# EAGLE design TB66 (EAGLE 9.6.2)
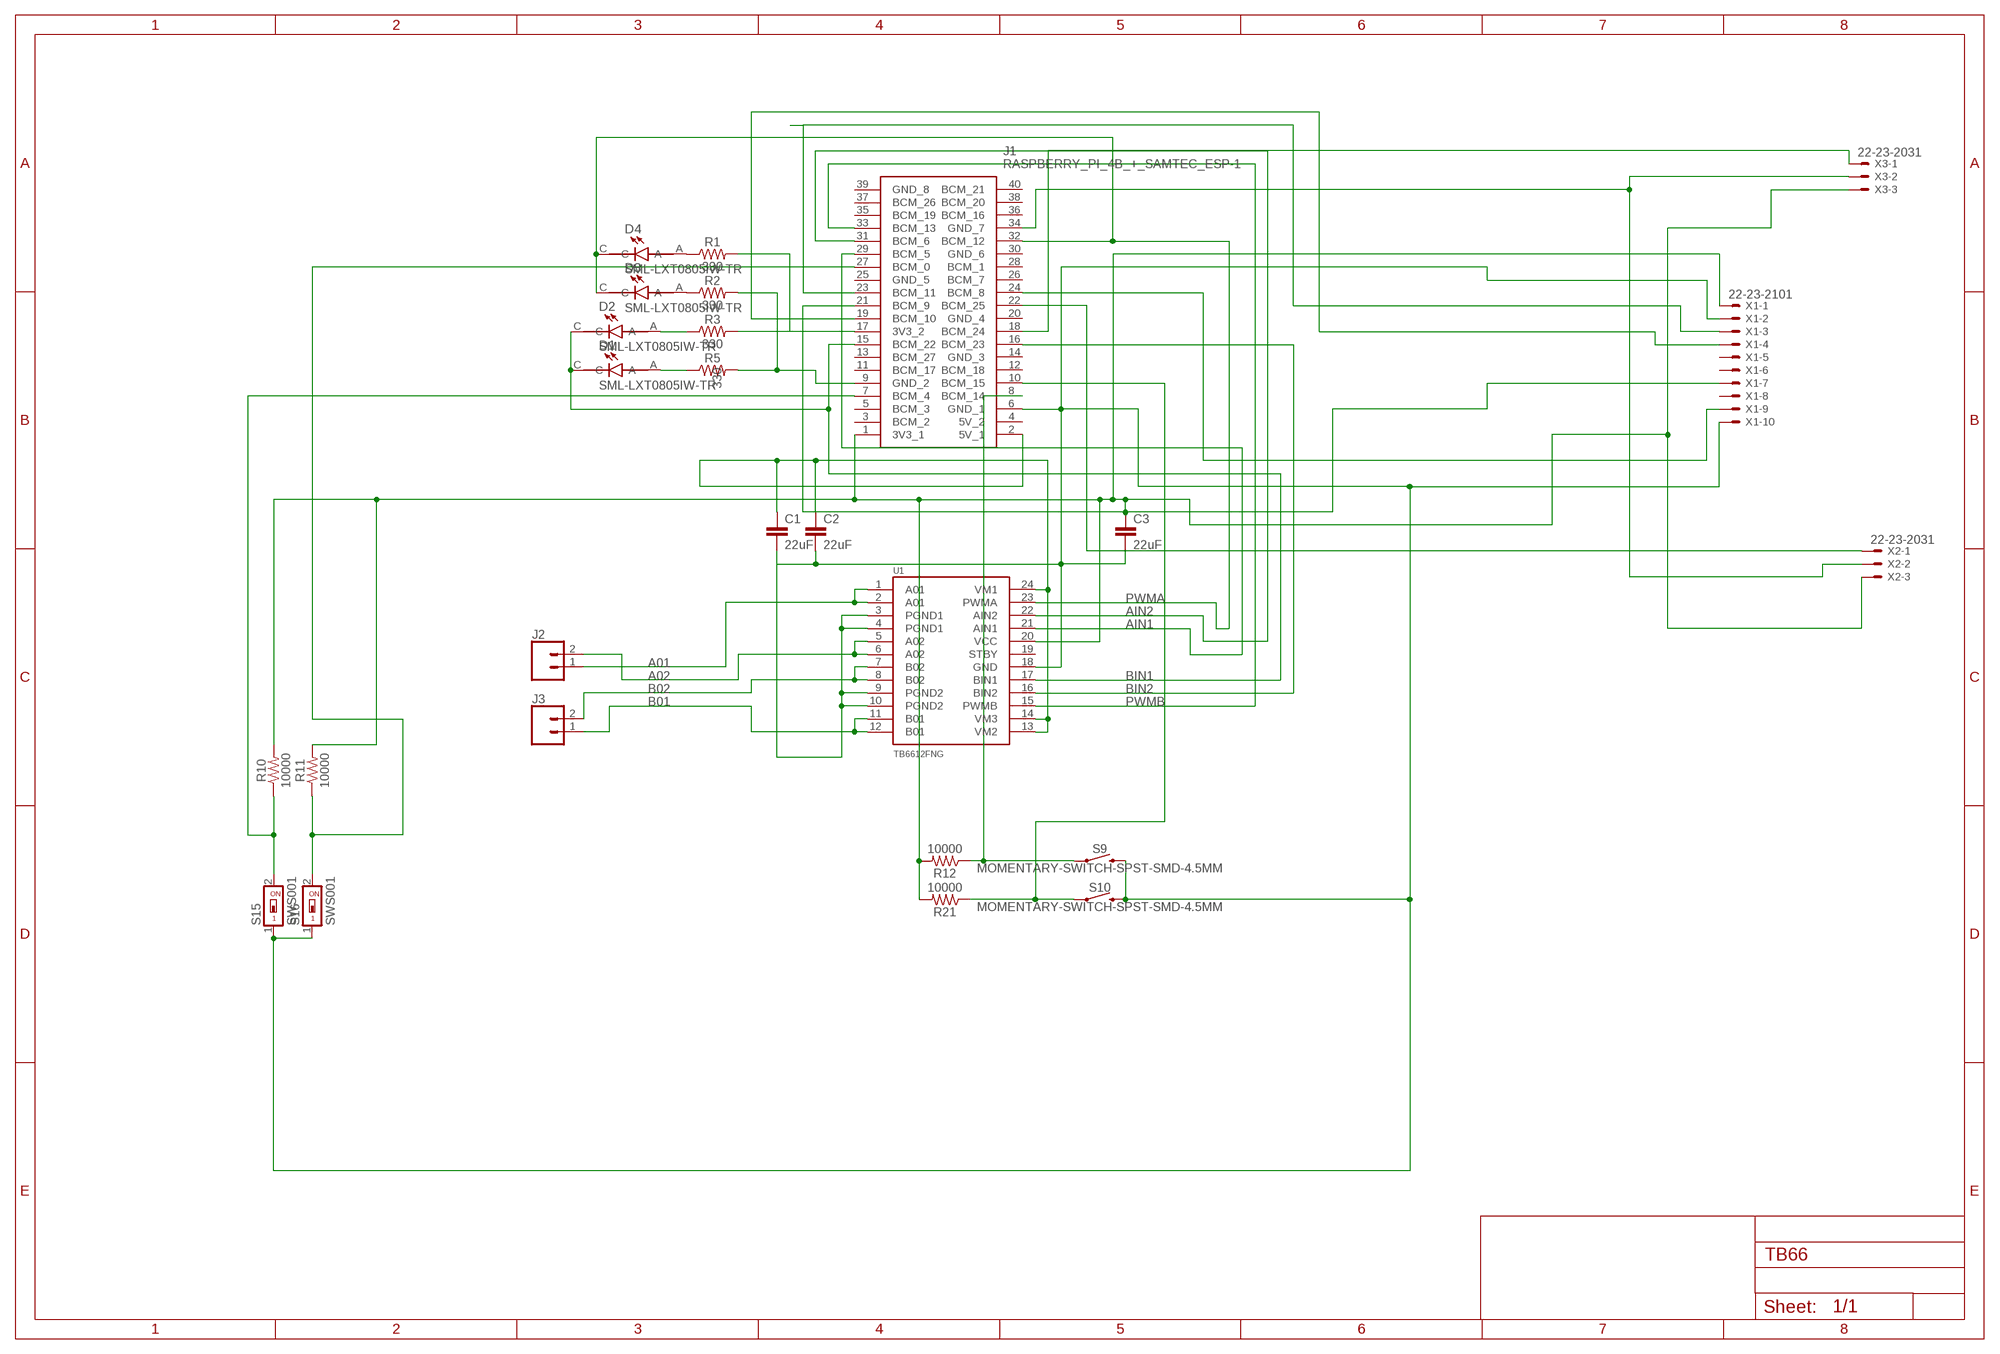
[diagram p0: schematic, sheet 1]

## Parts
C1  22uF  22UF-0805-6.3V-20%  [0805]
C2  22uF  22UF-0805-6.3V-20%  [0805]
C3  22uF  22UF-0805-6.3V-20%  [0805]
D1  SML-LXT0805IW-TR  [LEDC2012X120N]
D2  SML-LXT0805IW-TR  [LEDC2012X120N]
D3  SML-LXT0805IW-TR  [LEDC2012X120N]
D4  SML-LXT0805IW-TR  [LEDC2012X120N]
J1  RASPBERRY_PI_4B_+_SAMTEC_ESP-1  [RASPBERRYPI4B4GB]
J2  CONN_023.5MM  [SCREWTERMINAL-3.5MM-2]
J3  CONN_023.5MM  [SCREWTERMINAL-3.5MM-2]
R1  330  RESISTOR0805  [0805]
R2  330  RESISTOR0805  [0805]
R3  330  RESISTOR0805  [0805]
R5  330  RESISTOR0805  [0805]
R10  10000  RESISTOR0805  [0805]
R11  10000  RESISTOR0805  [0805]
R12  10000  RESISTOR0805  [0805]
R21  10000  RESISTOR0805  [0805]
S9  MOMENTARY-SWITCH-SPST-SMD-4.5MM  [TACTILE_SWITCH_SMD_4.5MM]
S10  MOMENTARY-SWITCH-SPST-SMD-4.5MM  [TACTILE_SWITCH_SMD_4.5MM]
S15  SWS001  [SMS-001]
S16  SWS001  [SMS-001]
U1  TB6612FNG  [SSOP24]
X1  22-23-2101  [22-23-2101]
X2  22-23-2031  [22-23-2031]
X3  22-23-2031  [22-23-2031]

## Nets
A01 [power]: J2.1 U1.1(A01) U1.2(A01)
A02 [power]: J2.2 U1.5(A02) U1.6(A02)
AIN1: J1.29(BCM_5) U1.21(AIN1)
AIN2: J1.31(BCM_6) U1.22(AIN2)
B01 [power]: J3.1 U1.11(B01) U1.12(B01)
B02 [power]: J3.2 U1.7(B02) U1.8(B02)
BIN1: D1.C D2.C J1.15(BCM_22) U1.17(BIN1)
BIN2: J1.16(BCM_23) U1.16(BIN2)
N$1: D3.A R2.1
N$2 [power]: J1.34(GND_7) X2.2 X3.2
N$3 [power]: C1.2 C2.2 C3.2 J1.6(GND_1) S9.1 S9.4 S10.1 S10.4 S15.1 S16.1 U1.3(PGND1) U1.4(PGND1) U1.9(PGND2) U1.10(PGND2) U1.18(GND) X1.2 X1.10
N$4 [power]: J1.17(3V3_2) R1.2 R3.2
N$5: D4.A R1.1
N$6: D1.A R5.1
N$7: J1.9(GND_2) R2.2 R5.2
N$8: D2.A R3.1
N$11 [power]: J1.18(BCM_24) X3.1
N$12: J1.23(BCM_11) X1.3
N$13: J1.19(BCM_10) X1.4
N$14: C3.1 J1.1(3V3_1) J1.21(BCM_9) R10.2 R11.2 R12.2 R21.2 U1.20(VCC) X1.1 X1.7 X2.3 X3.3
N$15: J1.24(BCM_8) X1.9
N$18 [power]: J1.22(BCM_25) X2.1
N$53: J1.8(BCM_14) R12.1 S9.2 S9.3
N$54: J1.10(BCM_15) R21.1 S10.2 S10.3
N$62: J1.7(BCM_4) R10.1 S15.2
N$63: J1.27(BCM_0) R11.1 S16.2
PWMA: D3.C D4.C J1.32(BCM_12) U1.23(PWMA)
PWMB: J1.33(BCM_13) U1.15(PWMB)
VM [power]: C1.1 C2.1 J1.2(5V_1) U1.13(VM2) U1.14(VM3) U1.24(VM1)
Unconnected: J1.3(BCM_2) J1.5(BCM_3) J1.11(BCM_17) J1.12(BCM_18) J1.13(BCM_27) J1.26(BCM_7) J1.28(BCM_1) J1.35(BCM_19) J1.36(BCM_16) J1.37(BCM_26) J1.38(BCM_20) J1.40(BCM_21) U1.19(STBY) X1.5 X1.6 X1.8

## Power pins joined to a net without a drawn wire
5V_2: J1.4(5V_2)
GND_3: J1.14(GND_3)
GND_4: J1.20(GND_4)
GND_5: J1.25(GND_5)
GND_6: J1.30(GND_6)
GND_8: J1.39(GND_8)

## Library data of the parts
C1-C3 = SparkFun-Capacitors:22UF: 22µF ceramic capacitors A capacitor is a passive two-terminal electrical component used to store electrical energy temporarily in an electric field.; PROD_ID: CAP-08402
D1-D4 = SML-LXT0805IW-TR:SML-LXT0805IW-TR: LED; Luminous Intensity:11µcd; Viewing Angle:140°; Forward Current:30mA; Forward Voltage:2V; Color:Red; LED Color:Red; Leaded Process Compatible:Yes; Lens Color:White; Mounting Type:Surface Mount ;RoHS Compliant: Yes Check availability <https://pricing.snapeda.com/parts/SML-LXT0805IW-TR/Lumex%20Opto/Components/view-part?ref=eda>; AVAILABILITY: In Stock; DESCRIPTION: Red - LED Indication - Discrete 2V 0805 (2012 Metric); MF: Lumex Opto/Components; MP: SML-LXT0805IW-TR; PACKAGE: 0805 Lumex; PRICE: None; PURCHASE-URL: https://pricing.snapeda.com/search/part/SML-LXT0805IW-TR/?ref=eda
J1 = RASPBERRY_PI_4B_+_Samtec_ESP-1:RASPBERRY_PI_4B_+_SAMTEC_ESP-1: RASPBERRY PI 4 MODEL B with Samtec ESP-120-33-G-D connector drawn from underneath for use as a plug in module. Source: Datasheet <https://www.raspberrypi.org/documentation/hardware/raspberrypi/mechanical/rpi_MECH_4b_4p0.pdf>; DESCRIPTION: RASPBERRY PI 4 MODEL B with Samtec ESP-120-33-G-D connector drawn from underneath for use as a plug in module.; HEIGHT: 24.3mm; MANUFACTURER_NAME: RASPBERRY-PI; MANUFACTURER_PART_NUMBER: RASPBERRY PI 4B + Samtec ESP-120-33-G-D
J2 J3 = SparkFun-Connectors:CONN_02: Multi connection point. Often used as Generic Header-pin footprint for 0.1 inch spaced/style header connections On any of the 0.1 inch spaced packages, you can populate with these: Break Away Headers - Straight <https://www.sparkfun.com/products/116> (PRT-00116) Break Away Male Headers - Right Angle <https://www.sparkfun.com/products/553> (PRT-00553) Female Headers <https://www.sparkfun.com/products/115> (PRT-00115) Break Away Headers - Machine Pin <https://www.sparkfun.com/products/117> (PRT-00117) Break Away Female Headers - Swiss Machine Pin <https://www.sparkfun.com/products/743> (PRT-00743) For SCREWTERMINALS and SPRING TERMINALS visit here: Screw Terimnals on SparkFun.com <https://www.sparkfun.com/search/results?term=Screw+Terminals> (5mm/3.5mm/2.54mm spacing) This device is also useful as a general connection point to wire up your design to another part of your project. Our various solder wires solder well into these plated through hole pads. Hook-Up Wire - Assortment (Stranded, 22 AWG) <https://www.sparkfun.com/products/11375> (PRT-11375) Hook-Up Wire - Assortment (Solid Core, 22 AWG) <https://www.sparkfun.com/products/11367> (PRT-11367) View the entire wire category on our website here <https://www.sparkfun.com/categories/141> Special notes: Molex polarized connector foot print use with: PRT-08233 with associated crimp pins and housings. 2.54_SCREWTERM for use with PRT-10571. 3.5mm Screw Terminal footprints for PRT-08084 5mm Screw Terminal footprints for use with PRT-08432; PROD_ID: CONN-08399
R1-R3 R5 R10-R12 R21 = SparkFun-Resistors:RESISTOR: Generic Resistor Package
S9 S10 = SparkFun-Switches:MOMENTARY-SWITCH-SPST: Momentary Switch (Pushbutton) - SPST Normally-open (NO) SPST momentary switches (buttons, pushbuttons). Variants PTH-12MM - 12mm square, through-hole Momentary Pushbutton Switch - 12mm Square <https://www.sparkfun.com/products/9190> (COM-09190) PTH-6.0MM, PTH-6.0MM-KIT - 6.0mm square, through-hole Mini Pushbutton Switch <https://www.sparkfun.com/products/97> (COM-00097) KIT package intended for soldering kit's - only one side of pads' copper is exposed. PTH-RIGHT-ANGLE-KIT - Right-angle, through-hole Right Angle Tactile Button <https://www.sparkfun.com/products/10791> - Used on SparkFun BigTime Watch Kit <https://www.sparkfun.com/products/11734> SMD-12MM - 12mm square, surface-mount Tactile Button - SMD (12mm) <https://www.sparkfun.com/products/12993> (COM-12993) Used on SparkFun PicoBoard <https://www.sparkfun.com/products/11888> SMD-4.5MM - 4.5mm Square Trackball Switch Used on SparkFun Blackberry Trackballer Breakout <https://www.sparkfun.com/products/13169> SMD-4.6MMX2.8MM - 4.60mm x 2.80mm, surface mount Used on SparkFun SAMD21 Mini Breakout <https://www.sparkfun.com/products/13664> SMD-5.2MM, SMD-5.2-REDUNDANT - 5.2mm square, surface-mount Mini Pushbutton Switch - SMD <https://www.sparkfun.com/products/8720> (COM-08720) Used on Arduino Pro Mini <https://www.sparkfun.com/products/11114> REDUNDANT package connects both switch circuits together SMD-6.0X3.5MM - 6.0 x 3.5mm, surface mount Momentary Reset Switch SMD <https://www.sparkfun.com/products/8229> (COM-08229) SMD-6.2MM-TALL - 6.2mm square, surface mount Tactile Button - SMD (6mm) <https://www.sparkfun.com/products/12992> Used on SparkFun Digital Sandbox <https://www.sparkfun.com/products/12651> SMD-RIGHT-ANGLE - Right-angle, surface mount Used on SparkFun Block for Intel® Edison - Arduino <https://www.sparkfun.com/products/13036>; PROD_ID: SWCH-09213
S15 S16 = smd-special:SWS001: SMD Dip Switch 1 pol.
U1 = SparkFun-IC-Special-Function:TB6612FNG: Toshiba 1A dual motor driver IC-09363; PROD_ID: IC-09363
X1 = con-molex:22-23-2101: .100" (2.54mm) Center Header - 10 Pin; MF: MOLEX; MPN: 22-23-2101; OC_FARNELL: 1756828; OC_NEWARK: 94C0765
X2 X3 = con-molex:22-23-2031: .100" (2.54mm) Center Header - 3 Pin; MF: MOLEX; MPN: 22-23-2031; OC_FARNELL: 1462950; OC_NEWARK: 30C0862

## Net classes
0 default: width 0.203 mm
1 power: width 0.635 mm

## Board
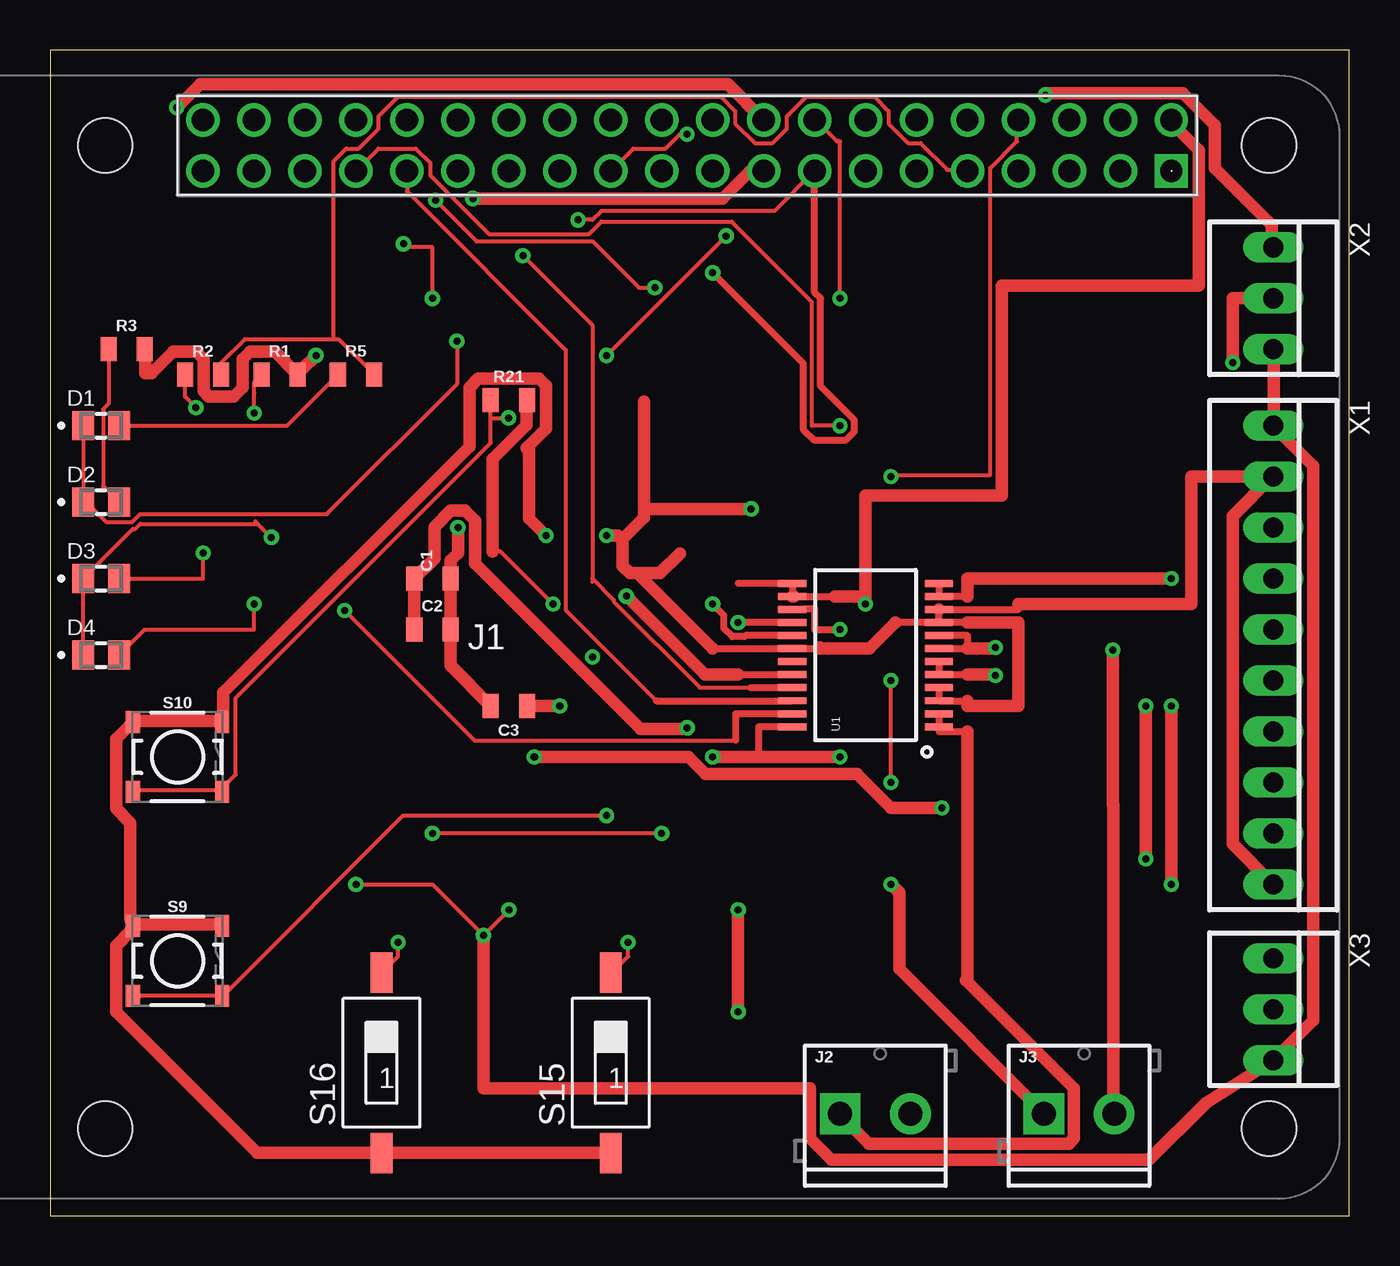
[diagram p1: board, top side]
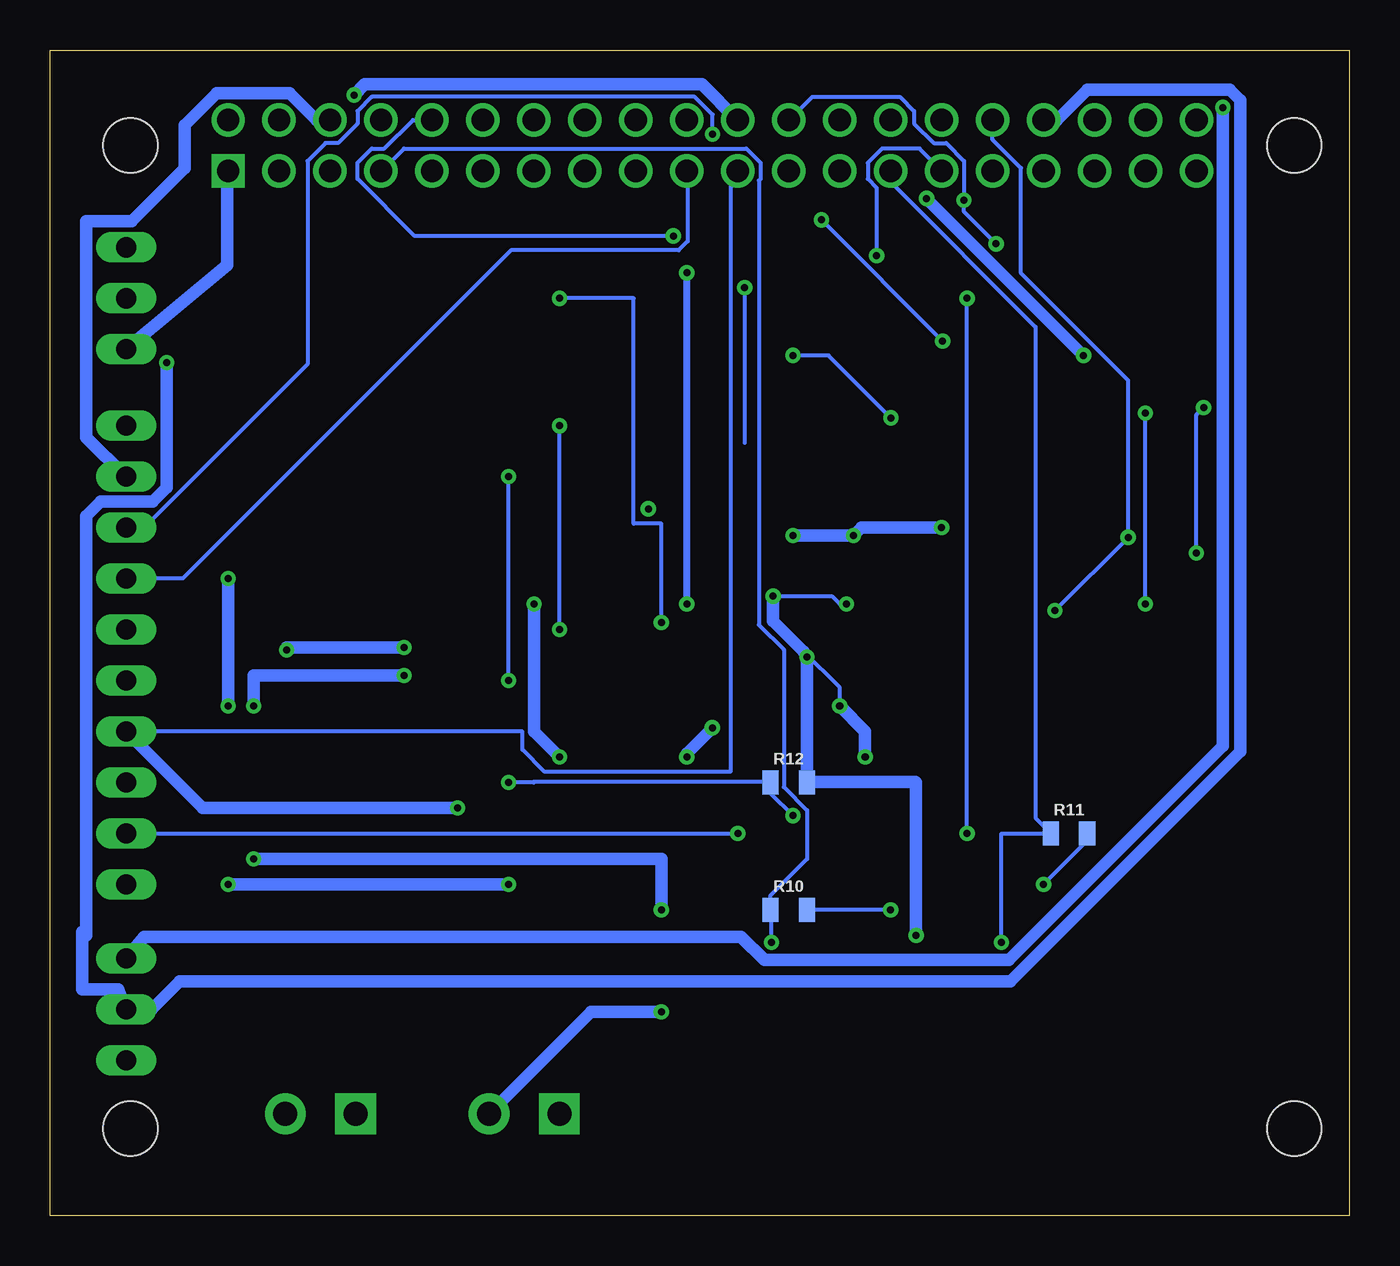
[diagram p2: board, bottom side, seen from below]

Size 64.75 x 58.09 mm. Coordinates in mm from the lower left corner, seen from the top.
Outline: 0,0 64.75,0 64.75,58.09 0,58.09 0,0
Copper layers (1*16): Top 0.035mm / dielectric 1.5mm / Bottom 0.035mm
Design rules "default": minimum track width 6mil, minimum drill 0.35mm, track to track 6mil, track to pad 6mil, pad to pad 6mil, via to via 6mil, smd to smd 6mil, copper to edge 40mil, drill to drill 6mil, minimum pad ring 10mil, minimum via ring 8mil, stop-mask expansion 4mil, vias tented up to drill 0mil, thermal gap 10mil

### Footprints (pad centres in the part's own frame; a part is rotated, then mirrored left to right if it is on the bottom)
0805 = smd 0.8 x 1.2: 1 -0.9,0; 2 0.9,0
LEDC2012X120N = smd 1.1 x 1.45: A 0.9,0; C -0.9,0
RASPBERRYPI4B4GB = drill 1.11 pad 1.64 square: 1 0,0 | drill 1.11 pad 1.64: 2 0,2.54; 3 -2.54,0; 4 -2.54,2.54; 5 -5.08,0; 6 -5.08,2.54; 7 -7.62,0; 8 -7.62,2.54; 9 -10.16,0; 10 -10.16,2.54; 11 -12.7,0; 12 -12.7,2.54; 13 -15.24,0; 14 -15.24,2.54; 15 -17.78,0; 16 -17.78,2.54; 17 -20.32,0; 18 -20.32,2.54; 19 -22.86,0; 20 -22.86,2.54; 21 -25.4,0; 22 -25.4,2.54; 23 -27.94,0; 24 -27.94,2.54; 25 -30.48,0; 26 -30.48,2.54; 27 -33.02,0; 28 -33.02,2.54; 29 -35.56,0; 30 -35.56,2.54; 31 -38.1,0; 32 -38.1,2.54; 33 -40.64,0; 34 -40.64,2.54; 35 -43.18,0; 36 -43.18,2.54; 37 -45.72,0; 38 -45.72,2.54; 39 -48.26,0; 40 -48.26,2.54 | hole 2.7: 4.87,1.27; -53.13,1.27; -53.13,-47.73; 4.87,-47.73
SCREWTERMINAL-3.5MM-2 = drill 1.2 pad 2.032 square: 1 0,0 | drill 1.2 pad 2.032: 2 3.5,0
TACTILE_SWITCH_SMD_4.5MM = smd 0.7 x 1.1: 1 2.225,1.75; 2 2.225,-1.75; 3 -2.225,-1.75; 4 -2.225,1.75
SMS-001 = smd 1.092 x 2.007: 1 0,-4.496; 2 0,4.496
SSOP24 = smd 0.348 x 1.397: 1 -3.575,-3.656; 2 -2.925,-3.656; 3 -2.275,-3.656; 4 -1.625,-3.656; 5 -0.975,-3.656; 6 -0.325,-3.656; 7 0.325,-3.656; 8 0.975,-3.656; 9 1.625,-3.656; 10 2.275,-3.656; 11 2.925,-3.656; 12 3.575,-3.656; 13 3.575,3.656; 14 2.925,3.656; 15 2.275,3.656; 16 1.625,3.656; 17 0.975,3.656; 18 0.325,3.656; 19 -0.325,3.656; 20 -0.975,3.656; 21 -1.625,3.656; 22 -2.275,3.656; 23 -2.925,3.656; 24 -3.575,3.656
22-23-2101 = drill 1 long: 1 -11.43,0; 2 -8.89,0; 3 -6.35,0; 4 -3.81,0; 5 -1.27,0; 6 1.27,0; 7 3.81,0; 8 6.35,0; 9 8.89,0; 10 11.43,0
22-23-2031 = drill 1 long: 1 -2.54,0; 2 0,0; 3 2.54,0

### Placement (x,y rotation side)
C1  19.05,31.75 0 top
C2  19.05,29.21 0 top
C3  22.86,25.4 180 top
D1  2.54,39.37 0 top
D2  2.54,35.56 0 top
D3  2.54,31.75 0 top
D4  2.54,27.94 0 top
J1  55.88,52.07 0 top
J2  39.37,5.08 0 top
J3  49.53,5.08 0 top
R1  11.43,41.91 0 top
R2  7.62,41.91 0 top
R3  3.81,43.18 0 top
R5  15.24,41.91 0 top
R10  27.94,15.24 0 bottom
R11  13.97,19.05 0 bottom
R12  27.94,21.59 0 bottom
R21  22.86,40.64 0 top
S9  6.35,12.7 0 top
S10  6.35,22.86 0 top
S15  27.94,7.62 0 top
S16  16.51,7.62 0 top
U1  40.64,27.94 90 top
X1  60.96,27.94 270 top
X2  60.96,45.72 270 top
X3  60.96,10.29 270 top

### Tracks (layer width: path | path; a pad name or v marks a point on that pad's centre or on a via)
A01
  Top 0.356: U1.2 U1.1 44.3,24.13 45.72,24.13
  Top 0.635: J2.1 39.38,5 40.8,3.58 50.76,3.58 51.03,3.85 51.03,6.34 45.63,11.73 45.72,11.73 45.72,24.13
A02  (via drill 0.35)
  Top 0.356: 45.72,26.96 U1.5 U1.6
  Top 0.635: v54.61,25.4 v54.61,17.78 | v34.29,15.24 v34.29,10.16 | 45.72,26.96 47.12,26.96 v47.12,26.92
  Bottom 0.635: v54.61,17.78 34.29,17.78 v34.29,15.24 | v34.29,10.16 37.79,10.16 J2.2 | v47.12,26.92 54.61,26.92 v54.61,25.4
AIN1  (via drill 0.35)
  Top 0.203: 27.03,31.75 27.03,44.39 v23.56,47.85 | 27.03,31.75 27.03,31.59 | 36.98,26.34 U1.21 | 35.48,26.39 35.56,26.32 32.38,26.32 28.08,30.61 28.08,30.69 27.03,31.75
  Top 0.356: 34.92,26.32 35.56,26.32 U1.21
  Bottom 0.203: v23.56,47.85 23.56,51.23 24,51.68 24,52.48 23.29,53.19 21.43,53.19 20.36,52.12 J1.29
AIN2
  Top 0.203: J1.31 17.78,51.05 25.69,43.14 25.69,30.19 30.21,25.66
  Top 0.356: 30.21,25.66 U1.22
B01  (via drill 0.35)
  Top 0.356: U1.12 U1.11 45.72,30.87 45.85,30.87
  Top 0.635: J3.1 42.32,12.29 42.32,16.1 v41.91,16.51 | v55.88,25.4 v55.88,16.51 | v55.88,31.75 45.72,31.75 45.72,30.87
  Bottom 0.635: v55.88,31.75 v55.88,25.4 | v55.88,16.51 v41.91,16.51
B02  (via drill 0.35)
  Top 0.356: U1.7 45.72,28.26 45.72,28.91 U1.8
  Top 0.635: J3.2 52.98,5.09 52.98,20.47 52.96,20.47 v52.96,28.19 | 45.72,28.26 47.12,28.26 v47.12,28.32
  Bottom 0.635: v52.96,28.19 52.96,28.32 v47.12,28.32
BIN1  (via drill 0.35)
  Top 0.203: 37.6,28.92 37.07,28.92 U1.17 | v20.27,43.59 20.27,41.45 13.78,34.96 4.48,34.96 4.09,34.58 2.79,34.58 1.81,35.56 D2.C D1.C | v26.31,49.63 27.03,49.63 27.47,50.08 36.09,50.08 38.05,52.03 J1.15
  Top 0.356: U1.17 34.64,28.91 34.58,28.86 34,28.86 33.58,29.27 33.58,29.92 v33.02,30.48 | J1.15 38.1,46.01 38.39,45.72 38.39,41.35 40.08,39.66 40.08,39.08 39.66,38.66 38.06,38.66 37.53,39.19 37.53,42.48 v33.02,46.99
  Bottom 0.203: v26.31,49.63 v20.27,43.59
  Bottom 0.356: v33.02,30.48 v33.02,46.99
BIN2  (via drill 0.35)
  Top 0.203: 37.07,29.63 U1.16 | J1.16 38.14,54.61 39.2,53.54 39.37,53.54 v39.37,45.72
  Top 0.356: U1.16 v34.29,29.57
  Top 0.635: v34.29,29.57 34.29,29.59
  Bottom 0.203: v34.29,29.57 34.29,34.5 35.67,34.5 35.67,45.72 v39.37,45.72
N$1  (via drill 0.35)
  Top 0.203: D3.A 7.62,31.75 v7.62,33.02 | v7.26,40.28 6.72,40.82 R2.1
  Bottom 0.203: v7.26,40.28 7.62,39.92 v7.62,33.02
N$2  (via drill 0.35)
  Top 0.635: v58.94,42.52 58.94,45.72 X2.2
  Bottom 0.635: 62.94,14.15 62.94,34.87 62.23,35.59 59.65,35.59 58.94,36.3 v58.94,42.52 | 62.94,14.15 62.94,13.97 | J1.34 14.58,54.61 13.07,56.12 5.96,56.12 5.42,55.59 5.42,23.14 16.89,11.67 58.31,11.67 59.69,10.29 X3.2 61.35,11.27 63.14,11.27 63.14,14.15 62.94,14.15
N$3  (via drill 0.35)
  Top 0.356: 45.72,29.57 U1.9 | U1.4 U1.3 45.72,25.66 | U1.10 48.26,30.22 48.26,30.48 | U1.9 42.14,29.57 | 33.02,28.26 U1.18 38.35,28.26 | U1.9 U1.10
  Top 0.635: 60.9,36.83 58.94,34.87 58.94,18.52 60.9,16.56 X1.10 | 60.9,36.83 X1.2 | S15.1 27.91,3.14 16.54,3.14 S16.1 16.18,3.14 10.31,3.14 3.29,10.16 3.29,13.45 4,14.16 S9.4 | 29.6,35.23 29.6,34.79 28.54,33.72 | 29.6,35.23 29.6,40.56 | 28.54,33.72 28.54,32.38 28.89,32.03 29.26,32.03 | 29.26,32.03 30.4,32.03 31.38,33.01 | S9.4 4.18,14.52 8.53,14.52 S9.1 | 23.86,38.37 24.71,39.23 24.71,41.36 24.36,41.72 21.34,41.72 20.89,41.27 20.89,38.34 8.62,26.07 8.62,24.92 S10.1 8.53,24.65 4.18,24.65 S10.4 3.91,24.38 3.29,23.76 3.29,20.3 4,19.58 4,14.78 S9.4 | 23.86,38.37 23.74,38.25 | v27.74,33.9 28.27,33.9 28.54,33.72 | 29.6,35.23 v34.94,35.23 | 45.72,29.57 48.26,29.57 48.26,25.4 45.72,25.4 45.72,25.66 | 48.26,30.48 56.88,30.48 56.88,36.83 60.9,36.83 | 38.35,28.32 38.35,28.26 40.84,28.26 42.14,29.57 | 29.26,32.03 33.02,28.26 | U1.10 | v20.32,34.29 20.32,33.02 19.95,32.65 C1.2 C2.2 19.95,27.41 C3.2 | v24.71,33.9 23.86,34.75 23.86,38.37
  Bottom 0.635: J1.6 51.47,54.61 52.81,55.94 56.45,55.94 58.05,54.34 58.05,52.21 60.69,49.57 62.94,49.57 62.94,38.79 60.98,36.83 X1.2 | v27.74,33.9 v24.71,33.9 24.32,34.29 v20.32,34.29
N$4  (via drill 0.35)
  Top 0.635: R3.2 4.74,41.99 5.07,41.99 6.13,43.05 7.29,43.05 7.64,42.7 7.64,41.1 7.91,40.83 9.16,40.83 9.6,41.27 9.6,42.7 9.96,43.05 11.2,43.05 12.27,41.99 R1.2 12.54,42.16 v13.25,42.88 | v21.07,50.7 33.52,50.7 34.85,52.03 35.56,52.03 J1.17
  Bottom 0.635: v13.25,42.88 v21.07,50.7
N$5  (via drill 0.35)
  Top 0.203: D4.A 4.71,29.21 10.16,29.21 v10.16,30.48 | v10.16,40 10.16,41.03 10.17,41.04 10.17,41.55 R1.1
  Bottom 0.203: v10.16,30.48 v10.16,40
N$6
  Top 0.203: D1.A 11.8,39.37 R5.1
N$7
  Top 0.203: 14.13,43.68 14.4,43.68 16.09,41.99 R5.2 | 14.13,43.68 9.69,43.68 8.53,42.52 8.53,41.99 R2.2 | 14.13,43.68 14.13,52.57 14.76,53.19 15.38,53.19 16.36,54.17 16.36,54.79 17.34,55.77 33.43,55.77 34.14,55.05 34.14,54.43 35.12,53.45 36.01,53.45 36.72,54.17 36.72,54.79 37.69,55.77 41.07,55.77 41.78,55.05 41.78,54.43 42.76,53.45 43.38,53.45 44.72,52.12 45.7,52.12 J1.9
N$8
  Top 0.203: R3.1 2.91,40.47 2.64,40.2 2.64,36.36 D2.A
N$11  (via drill 0.35)
  Top 0.635: v6.31,55.23 7.47,56.39 33.78,56.39 J1.18
  Bottom 0.635: v6.31,55.23 6.31,23.41 16.98,12.74 29.16,12.74 30.32,13.89 60.07,13.89 X3.1
N$12  (via drill 0.35)
  Top 0.203: v31.74,53.9 31.38,53.9 30.67,53.19 29.07,53.19 28,52.12 J1.23
  Bottom 0.203: v31.74,53.9 31.74,54.88 32.63,55.77 48.72,55.77 49.43,55.05 49.43,54.43 50.41,53.45 51.03,53.45 51.92,52.57 51.92,42.43 60.01,34.34 60.9,34.34 X1.3
N$13
  Bottom 0.203: X1.4 60.9,31.76 58.14,31.76 41.78,48.12 33.43,48.12 32.98,48.57 32.98,52.03 J1.19
N$14  (via drill 0.35)
  Top 0.203: v22.86,15.24 v21.59,13.97 19.05,16.51 v15.24,16.51 | v25.06,30.48 22.44,33.1 22.05,33.1
  Top 0.356: U1.20 34.28,26.96
  Top 0.635: v24.13,22.86 31.82,22.86 32.67,22.01 40.22,22.01 41.91,20.32 v44.45,20.32 | C3.1 v25.4,25.4 | 22.05,33.1 22.05,37.72 23.74,39.41 23.74,40.56 R21.2 | v28.71,30.87 32.63,26.96 34.28,26.96 | X2.3 60.98,43.17 60.98,39.68 X1.1 60.98,39.32 62.94,37.36 62.94,9.73 X3.3 57.62,5.63 54.76,2.78 38.94,2.78 37.87,3.85 37.87,6.34 37.86,6.35 21.59,6.35 v21.59,13.97
  Bottom 0.203: 60.9,24.21 X1.7 41.21,24.13 41.21,23.23 40.1,22.13 30.85,22.13 30.85,51.68 30.49,52.03 J1.21 | v25.4,25.4 25.4,26.31 27.2,28.12 | v28.71,30.87 25.79,30.87 25.4,30.48 v25.06,30.48 | v15.24,16.51 13.07,18.68 R11.2 | v22.86,15.24 R10.2
  Bottom 0.635: v25.4,25.4 24.13,24.13 v24.13,22.86 | v44.45,20.32 57.15,20.32 X1.7 | 27.03,21.63 v27.03,27.85 27.2,28.12 28.71,29.63 v28.71,30.87 | 27.03,21.63 R12.2 | J1.1 55.92,52.03 55.92,47.38 X2.3 | v21.59,13.97 21.59,21.59 21.63,21.63 27.03,21.63
N$15  (via drill 0.35)
  Top 0.203: v30.14,46.25 29.34,46.25 27.03,48.57 21.25,48.57 v19.2,50.61 | v19.05,45.72 19.05,48.26 17.78,48.26 v17.61,48.43 | v30.48,19.05 v19.05,19.05
  Bottom 0.203: v30.14,46.25 30.14,38.52 | J1.24 27.91,54.61 26.76,55.77 22.4,55.77 21.69,55.05 21.69,54.43 20.71,53.45 20.09,53.45 19.2,52.57 v19.2,50.61 19.2,50.03 v17.61,48.43 | X1.9 v30.48,19.05 | v19.05,19.05 v19.05,45.72
N$18  (via drill 0.35)
  Top 0.635: v49.61,55.85 49.7,55.94 56.45,55.94 58.05,54.34 58.05,52.21 60.9,49.37 60.9,48.32 X2.1
  Bottom 0.635: v49.61,55.85 49.07,56.39 32.27,56.39 30.49,54.61 J1.22
N$53  (via drill 0.35)
  Top 0.203: S9.3 4.18,10.96 8.53,10.96 S9.2 8.62,10.96 17.6,19.94 v27.74,19.94 | J1.8 48.18,54.61 48.18,53.54 46.85,52.21 46.85,36.92 41.91,36.92 v41.91,36.83 | v41.91,21.59 v41.91,26.67
  Bottom 0.203: v27.74,19.94 28.8,21.01 28.8,21.54 R12.1 28.89,21.63 40.64,21.63 40.64,21.59 v41.91,21.59 | v41.91,26.67 v41.91,36.83
N$54  (via drill 0.35)
  Top 0.203: S10.3 4.18,21.18 8.53,21.18 S10.2 8.53,21.27 9.25,21.98 9.25,25.81 21.96,38.52 21.96,39.76 | 21.96,39.76 21.96,40.56 R21.1 | v27.74,42.88 v33.69,48.83 | 21.96,39.76 v22.85,39.76
  Bottom 0.203: J1.10 46.67,54.61 48.09,53.19 48.72,53.19 49.43,52.48 49.43,51.68 46.58,48.83 v33.69,48.83 | v27.74,42.88 25.96,42.88 v22.85,39.76
N$62  (via drill 0.35)
  Top 0.203: v28.8,13.63 28.8,12.92 28,12.12 S15.2
  Bottom 0.203: J1.7 48.18,52.12 47.12,53.19 30.05,53.19 29.34,52.48 29.34,51.68 29.43,51.59 29.43,29.45 28.18,28.21 28.18,21.36 27.03,20.21 27.03,17.78 28.84,15.97 R10.1 28.8,15.23 v28.8,13.63
N$63  (via drill 0.35)
  Top 0.203: v17.34,13.63 17.34,12.92 16.54,12.12 S16.2
  Bottom 0.203: J1.27 22.85,52.03 22.85,51.5 15.65,44.3 15.65,19.83 R11.1 17.34,19.05 v17.34,13.63
PWMA  (via drill 0.35)
  Top 0.203: 37.6,25.01 37.07,25.01 U1.23 | v14.67,30.16 21.14,23.68 | 21.14,23.68 21.16,23.67 | 10.22,34.61 10.35,34.48 | 10.35,34.48 v11.02,33.81 | 21.14,23.68 34.16,23.68 | D4.C D3.C 4.12,34.23 4.24,34.23 4.5,34.48 10.35,34.48
  Top 0.356: U1.23 34.16,25.01 34.16,23.68
  Bottom 0.203: v14.67,30.16 v11.02,33.81 11.02,41.63 16.36,46.96 16.36,52.21 17.78,53.63 J1.32
PWMB  (via drill 0.35)
  Top 0.203: 37.6,30.25 37.07,30.25 U1.15 | J1.33 16.36,53.19 18.22,53.19 18.94,52.48 18.94,51.85 21.87,48.92 26.85,48.92 27.47,49.54 33.96,49.54 37.96,45.54 37.96,39.37 v39.37,39.37
  Top 0.356: 37.6,30.25 38.1,30.25 38.1,29.21 v39.37,29.21
  Bottom 0.203: v39.37,29.21 v39.37,39.37
VM  (via drill 0.35)
  Top 0.356: 34.29,31.51 U1.13 U1.14 | 37.08,30.87 39.11,30.87 | U1.24 35.31,24.37 35.31,22.86
  Top 0.635: J1.2 55.92,54.61 55.92,54.43 57.25,53.1 57.25,46.34 47.42,46.34 47.42,35.88 40.64,35.88 v40.64,30.48 40.64,30.87 39.11,30.87 | U1.14 37.06,30.87 37.07,30.87 37.08,30.87 | v39.37,22.86 35.56,22.86 35.31,22.86 v33.02,22.86 | C2.1 C1.1 19.16,32.76 19.16,34.33 19.97,35.14 20.67,35.14 21.17,34.64 21.17,32.51 29.42,24.26 31.75,24.26 v31.75,24.32
  Bottom 0.635: v39.37,22.86 40.64,24.13 v40.64,30.48 | v31.75,24.32 33.02,23.05 v33.02,22.86